# Altium schematic sheet rasp.SchDoc
size A3
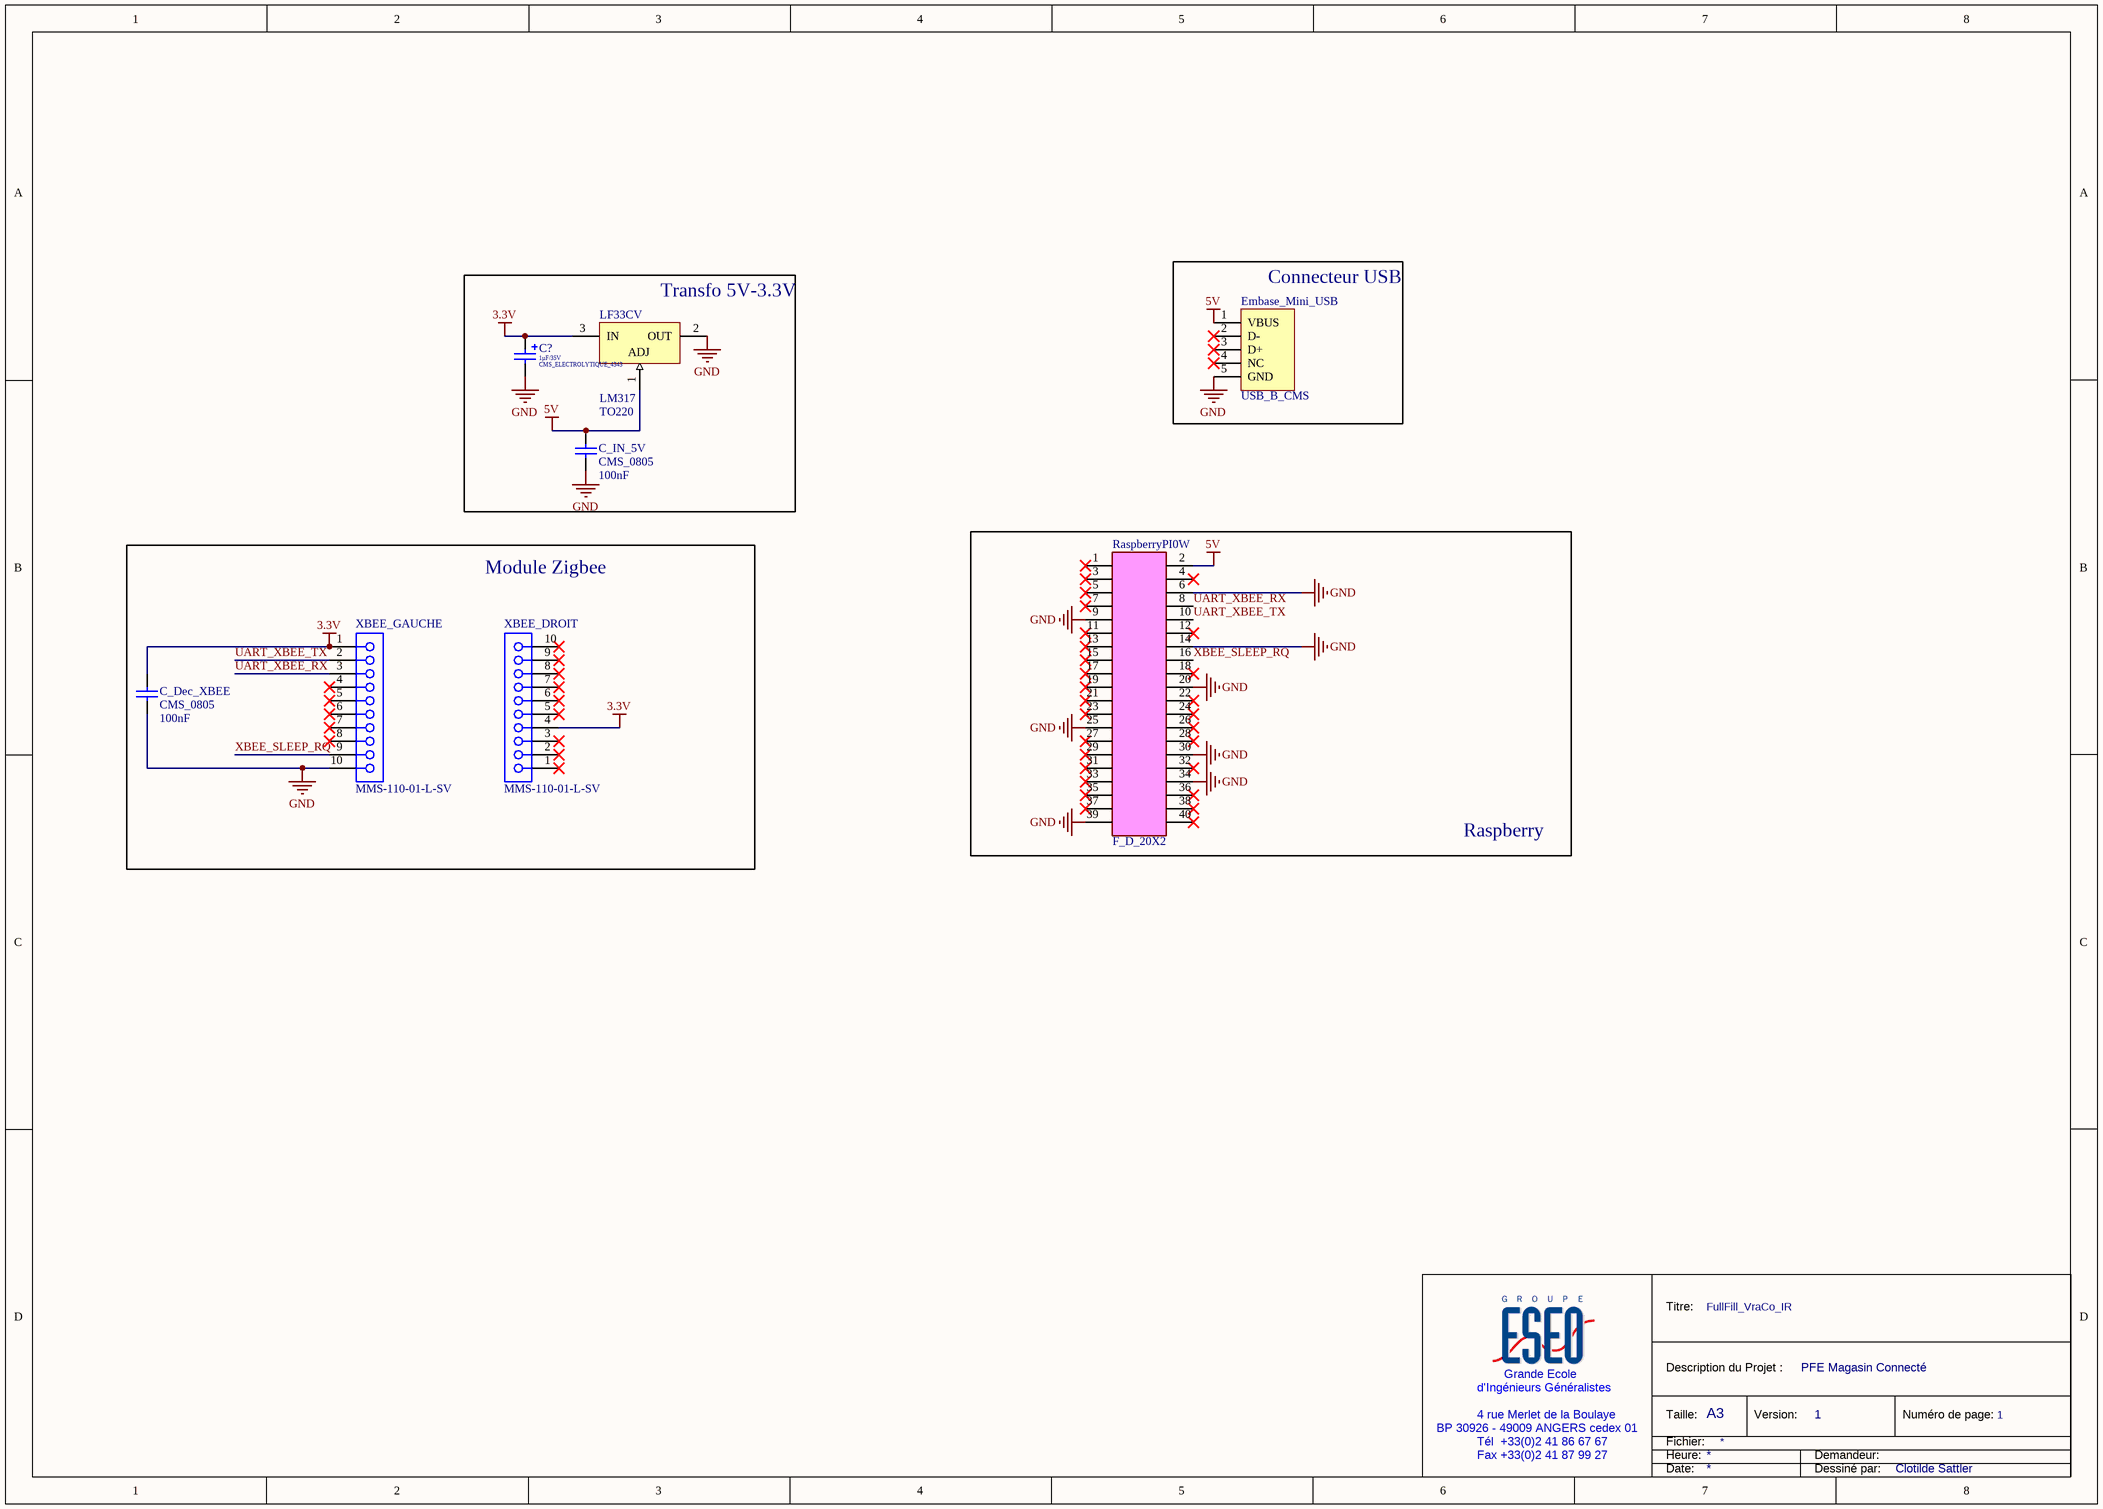
[diagram p0: rasp.SchDoc]

## Parts
C?  value 1µF/35V  Type: CMS_ELECTROLYTIQUE_4343  [CONDENSATEUR_CMS_POLARISE_ELECTROLYTIQUE_B/4343]  (hidden comment: CMS_POLARISE_ELECTROLYTIQUE_B)
C_Dec_XBEE  value 100nF  [CONDENSATEUR_CMS_0805]  (hidden comment: CMS_0805)
C_IN_5V  value 100nF  [CONDENSATEUR_CMS_0805]  (hidden comment: CMS_0805)
Embase_Mini_USB  USB_B_CMS  [USB_MINI_B]
LF33CV  Type: LM317  Package: TO220  [REGULATEUR_TO220_LM317]  (hidden comment: REGULATEUR_TO220_LM317)
RaspberryPI0W  Type: F_D_20X2  [BARRETTE_20X2_F_D]  (hidden comment: BARRETTE_20 CONTACTS_2 RANGEES_FEMELLE_DROITE)
XBEE_DROIT  MMS-110-01-L-SV  [SMTC-MMS-110-01-X-SV]
XBEE_GAUCHE  MMS-110-01-L-SV  [SMTC-MMS-110-01-X-SV]

## Blocks framed on the sheet
Transfo 5V-3.3V: C? C_IN_5V LF33CV
Connecteur USB: Embase_Mini_USB
Module Zigbee: C_Dec_XBEE XBEE_DROIT XBEE_GAUCHE
Raspberry: RaspberryPI0W

## Nets
3.3V: C?.1 C_Dec_XBEE.2 LF33CV.3(IN) XBEE_DROIT.4 XBEE_GAUCHE.1
5V: C_IN_5V.2 Embase_Mini_USB.1(VBUS) LF33CV.1(ADJ) RaspberryPI0W.2
GND: C?.2 C_Dec_XBEE.1 C_IN_5V.1 Embase_Mini_USB.5(GND) LF33CV.2(OUT) RaspberryPI0W.6 RaspberryPI0W.9 RaspberryPI0W.14 RaspberryPI0W.20 RaspberryPI0W.25 RaspberryPI0W.30 RaspberryPI0W.34 RaspberryPI0W.39 XBEE_GAUCHE.10
UART_XBEE_RX: RaspberryPI0W.8 XBEE_GAUCHE.3
UART_XBEE_TX: RaspberryPI0W.10 XBEE_GAUCHE.2
XBEE_SLEEP_RQ: RaspberryPI0W.16 XBEE_GAUCHE.9

Not connected (* = marked no-connect by the designer): Embase_Mini_USB 2(D-)* 3(D+)* 4(NC)*; RaspberryPI0W 1(3V)* 3* 4* 5* 7* 11* 12* 13* 15* 17* 18* 19* 21* 22* 23* 24* 26* 27* 28* 29* 31* 32* 33* 35* 36* 37* 38* 40*; XBEE_DROIT 1(11)* 2(12)* 3(13)* 5(15)* 6(16)* 7(17)* 8(18)* 9(19)* 10(20)*; XBEE_GAUCHE 4* 5* 6* 7* 8*

## Notes on the sheet
- Titre:
- FullFill_VraCo_IR
- d'Ingénieurs Généralistes
- Grande Ecole
- Description du Projet :
- PFE Magasin Connecté
- BP 30926 - 49009 ANGERS cedex 01
- 4 rue Merlet de la Boulaye
- Tél  +33(0)2 41 86 67 67
- Fax +33(0)2 41 87 99 27
- Taille:
- Heure:
- Fichier:
- A3
- Version:
- 1
- Demandeur:
- Numéro de page:
- Date:
- Dessiné par:
- Clotilde Sattler

## Library data of the parts
C? = CONDENSATEUR_CMS_POL_ELECTROLY_B_4343: CONDENSATEUR CMS POLARISE ELECTROLYTIQUE BOITIER B/4343
C_Dec_XBEE C_IN_5V = CONDENSATEUR_CMS_CER_0805: CONDENSATEUR CMS CERAMIQUE 0805; Type: CMS_0805
Embase_Mini_USB = USB_B_CMS: EMBASE USB CMS TYPE B; Type: USB_B_CMS
LF33CV = REGULATEUR_TO220_LM317: REGULATEUR  DE TENSION DE SORTIE AJUSTABLE BOITIER TO220
XBEE_DROIT XBEE_GAUCHE = MMS-110-01-L-SV: Tiger Claw(TM) Socket Strip, Through-hole, Vertical, -55 to 125 degC, 2 mm Pitch, 10-Pin, Female, RoHS; Manufacturer: Samtec; Pitch: 2 mm; DatasheetVersion: F-214; PackageVersion: AO, 2/1993; PackageReference: MMS-110-01-X-SV; PackageDescription: 2mm Through Hole Box Connector Strip Assembly; Supplier 1: Digi-Key; Supplier Part Number 1: SAM1230-10-ND; Supplier 2: Farnell; Supplier Part Number 2: 1885919; Supplier 3: Newark; Supplier Part Number 3: 41T0710; Supplier 4: Newark; Supplier Part Number 4: 96M0485; Orientation: Vertical; RoHS: True; Temperature Range: -55 to 125 degC; Mounting Technology: Through-hole; PartNumber: MMS-110-01-L-SV; ComponentLink1Description: Manufacturer URL; ComponentLink1URL: http://www.samtec.com; ComponentLink2Description: Datasheet; ComponentLink2URL: http://www.samtec.com/documents/webfiles/pdf/MMS.PDF; ComponentLink3Description: Package Specification; ComponentLink3URL: http://www.samtec.com/documents/webfiles/cpdf/MMS-1XX-01-XXX-XX-XXX-MKT1.pdf